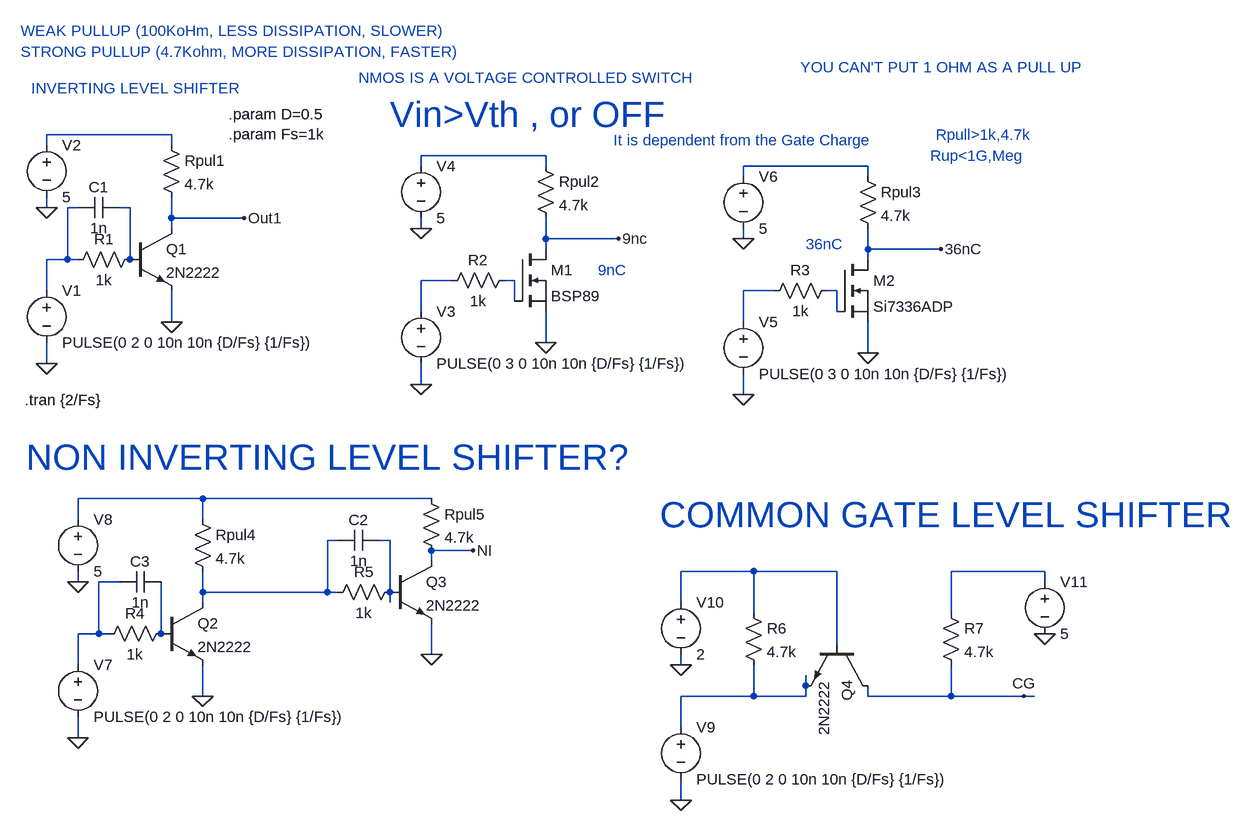
[diagram p0: schematic LevelShifters.asc]
LevelShifters.asc, the LTspice schematic file:
Version 4
SHEET 1 1680 1060
WIRE 80 16 -112 16
WIRE -112 32 -112 16
WIRE 80 32 80 16
WIRE 656 48 464 48
WIRE 464 64 464 48
WIRE 656 64 656 48
WIRE 1152 64 960 64
WIRE 960 80 960 64
WIRE 1152 80 1152 64
WIRE -112 128 -112 112
WIRE -64 128 -80 128
WIRE 16 128 0 128
WIRE 80 144 80 112
WIRE 192 144 80 144
WIRE 80 160 80 144
WIRE 464 160 464 144
WIRE 656 176 656 144
WIRE 768 176 656 176
WIRE 960 176 960 160
WIRE 656 192 656 176
WIRE 1152 192 1152 160
WIRE 1264 192 1152 192
WIRE -80 208 -80 128
WIRE -80 208 -112 208
WIRE -64 208 -80 208
WIRE 16 208 16 128
WIRE 1152 208 1152 192
WIRE 512 240 464 240
WIRE 608 240 592 240
WIRE -112 256 -112 208
WIRE 1008 256 960 256
WIRE 1104 256 1088 256
WIRE 608 272 608 240
WIRE 464 288 464 240
WIRE 1104 288 1104 256
WIRE 80 304 80 256
WIRE 960 304 960 256
WIRE 656 336 656 288
WIRE 1152 352 1152 304
WIRE -112 368 -112 336
WIRE 464 400 464 368
WIRE 960 416 960 384
WIRE 128 576 -64 576
WIRE 480 576 128 576
WIRE -64 608 -64 576
WIRE 128 608 128 576
WIRE 336 640 320 640
WIRE 416 640 400 640
WIRE 544 656 480 656
WIRE 480 672 480 656
WIRE 976 688 864 688
WIRE 1104 688 976 688
WIRE 1424 688 1280 688
WIRE -64 704 -64 688
WIRE 0 704 -32 704
WIRE 1424 704 1424 688
WIRE 128 720 128 688
WIRE 320 720 320 640
WIRE 320 720 128 720
WIRE 336 720 320 720
WIRE 416 720 416 640
WIRE 128 736 128 720
WIRE 416 736 416 720
WIRE 864 736 864 688
WIRE 976 752 976 688
WIRE 1280 752 1280 688
WIRE -32 784 -32 704
WIRE -32 784 -64 784
WIRE -16 784 -32 784
WIRE 64 784 64 704
WIRE 1104 800 1104 688
WIRE 480 816 480 768
WIRE -64 832 -64 784
WIRE 864 832 864 816
WIRE 1056 864 1056 848
WIRE 128 880 128 832
WIRE 976 880 976 832
WIRE 976 880 864 880
WIRE 1056 880 1056 864
WIRE 1056 880 976 880
WIRE 1152 880 1152 864
WIRE 1280 880 1280 832
WIRE 1280 880 1152 880
WIRE 1392 880 1280 880
WIRE 1408 880 1392 880
WIRE 864 928 864 880
WIRE -64 944 -64 912
WIRE 864 1040 864 1008
FLAG -112 368 0
FLAG 80 304 0
FLAG -112 128 0
FLAG 192 144 Out1
FLAG 464 400 0
FLAG 656 336 0
FLAG 464 160 0
FLAG 768 176 9nc
FLAG 960 416 0
FLAG 1152 352 0
FLAG 960 176 0
FLAG 1264 192 36nC
FLAG -64 944 0
FLAG 128 880 0
FLAG -64 704 0
FLAG 480 816 0
FLAG 864 1040 0
FLAG 864 832 0
FLAG 1424 784 0
FLAG 1392 880 CG
FLAG 544 656 NI
SYMBOL npn 16 160 R0
SYMATTR InstName Q1
SYMATTR Value 2N2222
SYMBOL voltage -112 240 R0
WINDOW 123 0 0 Left 0
WINDOW 39 0 0 Left 0
SYMATTR InstName V1
SYMATTR Value PULSE(0 2 0 10n 10n {D/Fs} {1/Fs})
SYMBOL res 32 192 R90
WINDOW 0 0 56 VBottom 2
WINDOW 3 32 56 VTop 2
SYMATTR InstName R1
SYMATTR Value 1k
SYMBOL res 64 16 R0
SYMATTR InstName Rpul1
SYMATTR Value 4.7k
SYMBOL voltage -112 16 R0
SYMATTR InstName V2
SYMATTR Value 5
SYMBOL voltage 464 272 R0
WINDOW 123 0 0 Left 0
WINDOW 39 0 0 Left 0
SYMATTR InstName V3
SYMATTR Value PULSE(0 3 0 10n 10n {D/Fs} {1/Fs})
SYMBOL res 608 224 R90
WINDOW 0 0 56 VBottom 2
WINDOW 3 32 56 VTop 2
SYMATTR InstName R2
SYMATTR Value 1k
SYMBOL res 640 48 R0
SYMATTR InstName Rpul2
SYMATTR Value 4.7k
SYMBOL voltage 464 48 R0
SYMATTR InstName V4
SYMATTR Value 5
SYMBOL nmos 608 192 R0
SYMATTR InstName M1
SYMATTR Value BSP89
SYMBOL voltage 960 288 R0
WINDOW 123 0 0 Left 0
WINDOW 39 0 0 Left 0
SYMATTR InstName V5
SYMATTR Value PULSE(0 3 0 10n 10n {D/Fs} {1/Fs})
SYMBOL res 1104 240 R90
WINDOW 0 0 56 VBottom 2
WINDOW 3 32 56 VTop 2
SYMATTR InstName R3
SYMATTR Value 1k
SYMBOL res 1136 64 R0
SYMATTR InstName Rpul3
SYMATTR Value 4.7k
SYMBOL voltage 960 64 R0
SYMATTR InstName V6
SYMATTR Value 5
SYMBOL nmos 1104 208 R0
SYMATTR InstName M2
SYMATTR Value Si7336ADP
SYMBOL npn 64 736 R0
SYMATTR InstName Q2
SYMATTR Value 2N2222
SYMBOL voltage -64 816 R0
WINDOW 123 0 0 Left 0
WINDOW 39 0 0 Left 0
SYMATTR InstName V7
SYMATTR Value PULSE(0 2 0 10n 10n {D/Fs} {1/Fs})
SYMBOL res 80 768 R90
WINDOW 0 0 56 VBottom 2
WINDOW 3 32 56 VTop 2
SYMATTR InstName R4
SYMATTR Value 1k
SYMBOL res 112 592 R0
SYMATTR InstName Rpul4
SYMATTR Value 4.7k
SYMBOL voltage -64 592 R0
SYMATTR InstName V8
SYMATTR Value 5
SYMBOL npn 416 672 R0
SYMATTR InstName Q3
SYMATTR Value 2N2222
SYMBOL res 432 704 R90
WINDOW 0 0 56 VBottom 2
WINDOW 3 32 56 VTop 2
SYMATTR InstName R5
SYMATTR Value 1k
SYMBOL res 464 560 R0
SYMATTR InstName Rpul5
SYMATTR Value 4.7k
SYMBOL npn 1152 800 R90
SYMATTR InstName Q4
SYMATTR Value 2N2222
SYMBOL voltage 864 912 R0
WINDOW 123 0 0 Left 0
WINDOW 39 0 0 Left 0
SYMATTR InstName V9
SYMATTR Value PULSE(0 2 0 10n 10n {D/Fs} {1/Fs})
SYMBOL voltage 864 720 R0
SYMATTR InstName V10
SYMATTR Value 2
SYMBOL res 960 736 R0
SYMATTR InstName R6
SYMATTR Value 4.7k
SYMBOL voltage 1424 688 R0
SYMATTR InstName V11
SYMATTR Value 5
SYMBOL res 1264 736 R0
SYMATTR InstName R7
SYMATTR Value 4.7k
SYMBOL cap 0 112 R90
WINDOW 0 0 32 VBottom 2
WINDOW 3 32 32 VTop 2
SYMATTR InstName C1
SYMATTR Value 1n
SYMBOL cap 400 624 R90
WINDOW 0 0 32 VBottom 2
WINDOW 3 32 32 VTop 2
SYMATTR InstName C2
SYMATTR Value 1n
SYMBOL cap 64 688 R90
WINDOW 0 0 32 VBottom 2
WINDOW 3 32 32 VTop 2
SYMATTR InstName C3
SYMATTR Value 1n
TEXT 168 -16 Left 2 !.param D=0.5\n.param Fs=1k
TEXT -146 424 Left 2 !.tran {2/Fs}
TEXT 368 -72 Left 2 ;NMOS IS A VOLTAGE CONTROLLED SWITCH
TEXT 416 -16 Left 5 ;Vin>Vth , or OFF
TEXT 760 24 Left 2 ;It is dependent from the Gate Charge
TEXT 736 224 Left 2 ;9nC
TEXT 1056 184 Left 2 ;36nC
TEXT -144 512 Left 5 ;NON INVERTING LEVEL SHIFTER?
TEXT 832 600 Left 5 ;COMMON GATE LEVEL SHIFTER
TEXT -136 -56 Left 2 ;INVERTING LEVEL SHIFTER
TEXT -152 -144 Left 2 ;WEAK PULLUP (100KoHm, LESS DISSIPATION, SLOWER)
TEXT -152 -112 Left 2 ;STRONG PULLUP (4.7Kohm, MORE DISSIPATION, FASTER)
TEXT 1048 -88 Left 2 ;YOU CAN'T PUT 1 OHM AS A PULL UP
TEXT 1256 16 Left 2 ;Rpull>1k,4.7k
TEXT 1248 48 Left 2 ;Rup<1G,Meg

The netlist it stands for:
* LevelShifters.asc
Q1 Out1 N005 0 0 2N2222
V1 N004 0 PULSE(0 2 0 10n 10n {D/Fs} {1/Fs})
R1 N005 N004 1k
Rpul1 N001 Out1 4.7k
V2 N001 0 5
V3 N006 0 PULSE(0 3 0 10n 10n {D/Fs} {1/Fs})
R2 N007 N006 1k
Rpul2 N002 9nc 4.7k
V4 N002 0 5
M1 9nc N007 0 0 BSP89
V5 N008 0 PULSE(0 3 0 10n 10n {D/Fs} {1/Fs})
R3 N009 N008 1k
Rpul3 N003 36nC 4.7k
V6 N003 0 5
M2 36nC N009 0 0 Si7336ADP
Q2 N011 N016 0 0 2N2222
V7 N015 0 PULSE(0 2 0 10n 10n {D/Fs} {1/Fs})
R4 N016 N015 1k
Rpul4 N010 N011 4.7k
V8 N010 0 5
Q3 NI N012 0 0 2N2222
R5 N012 N011 1k
Rpul5 N010 NI 4.7k
Q4 CG N013 N017 0 2N2222
V9 N017 0 PULSE(0 2 0 10n 10n {D/Fs} {1/Fs})
V10 N013 0 2
R6 N013 N017 4.7k
V11 N014 0 5
R7 N014 CG 4.7k
C1 N005 N004 1n
C2 N012 N011 1n
C3 N016 N015 1n
.model NPN NPN
.model PNP PNP
.lib standard.bjt
.model NMOS NMOS
.model PMOS PMOS
.lib standard.mos
.param D=0.5
.param Fs=1k
.tran {2/Fs}
* NMOS IS A VOLTAGE CONTROLLED SWITCH
* Vin>Vth , or OFF
* It is dependent from the Gate Charge
* 9nC
* 36nC
* NON INVERTING LEVEL SHIFTER?
* COMMON GATE LEVEL SHIFTER
* INVERTING LEVEL SHIFTER
* WEAK PULLUP (100KoHm, LESS DISSIPATION, SLOWER)
* STRONG PULLUP (4.7Kohm, MORE DISSIPATION, FASTER)
* YOU CAN'T PUT 1 OHM AS A PULL UP
* Rpull>1k,4.7k
* Rup<1G,Meg
.backanno
.end